# Altium schematic sheet Sheet1.SchDoc
size A3; SheetNumber: 1; SheetTotal: 1
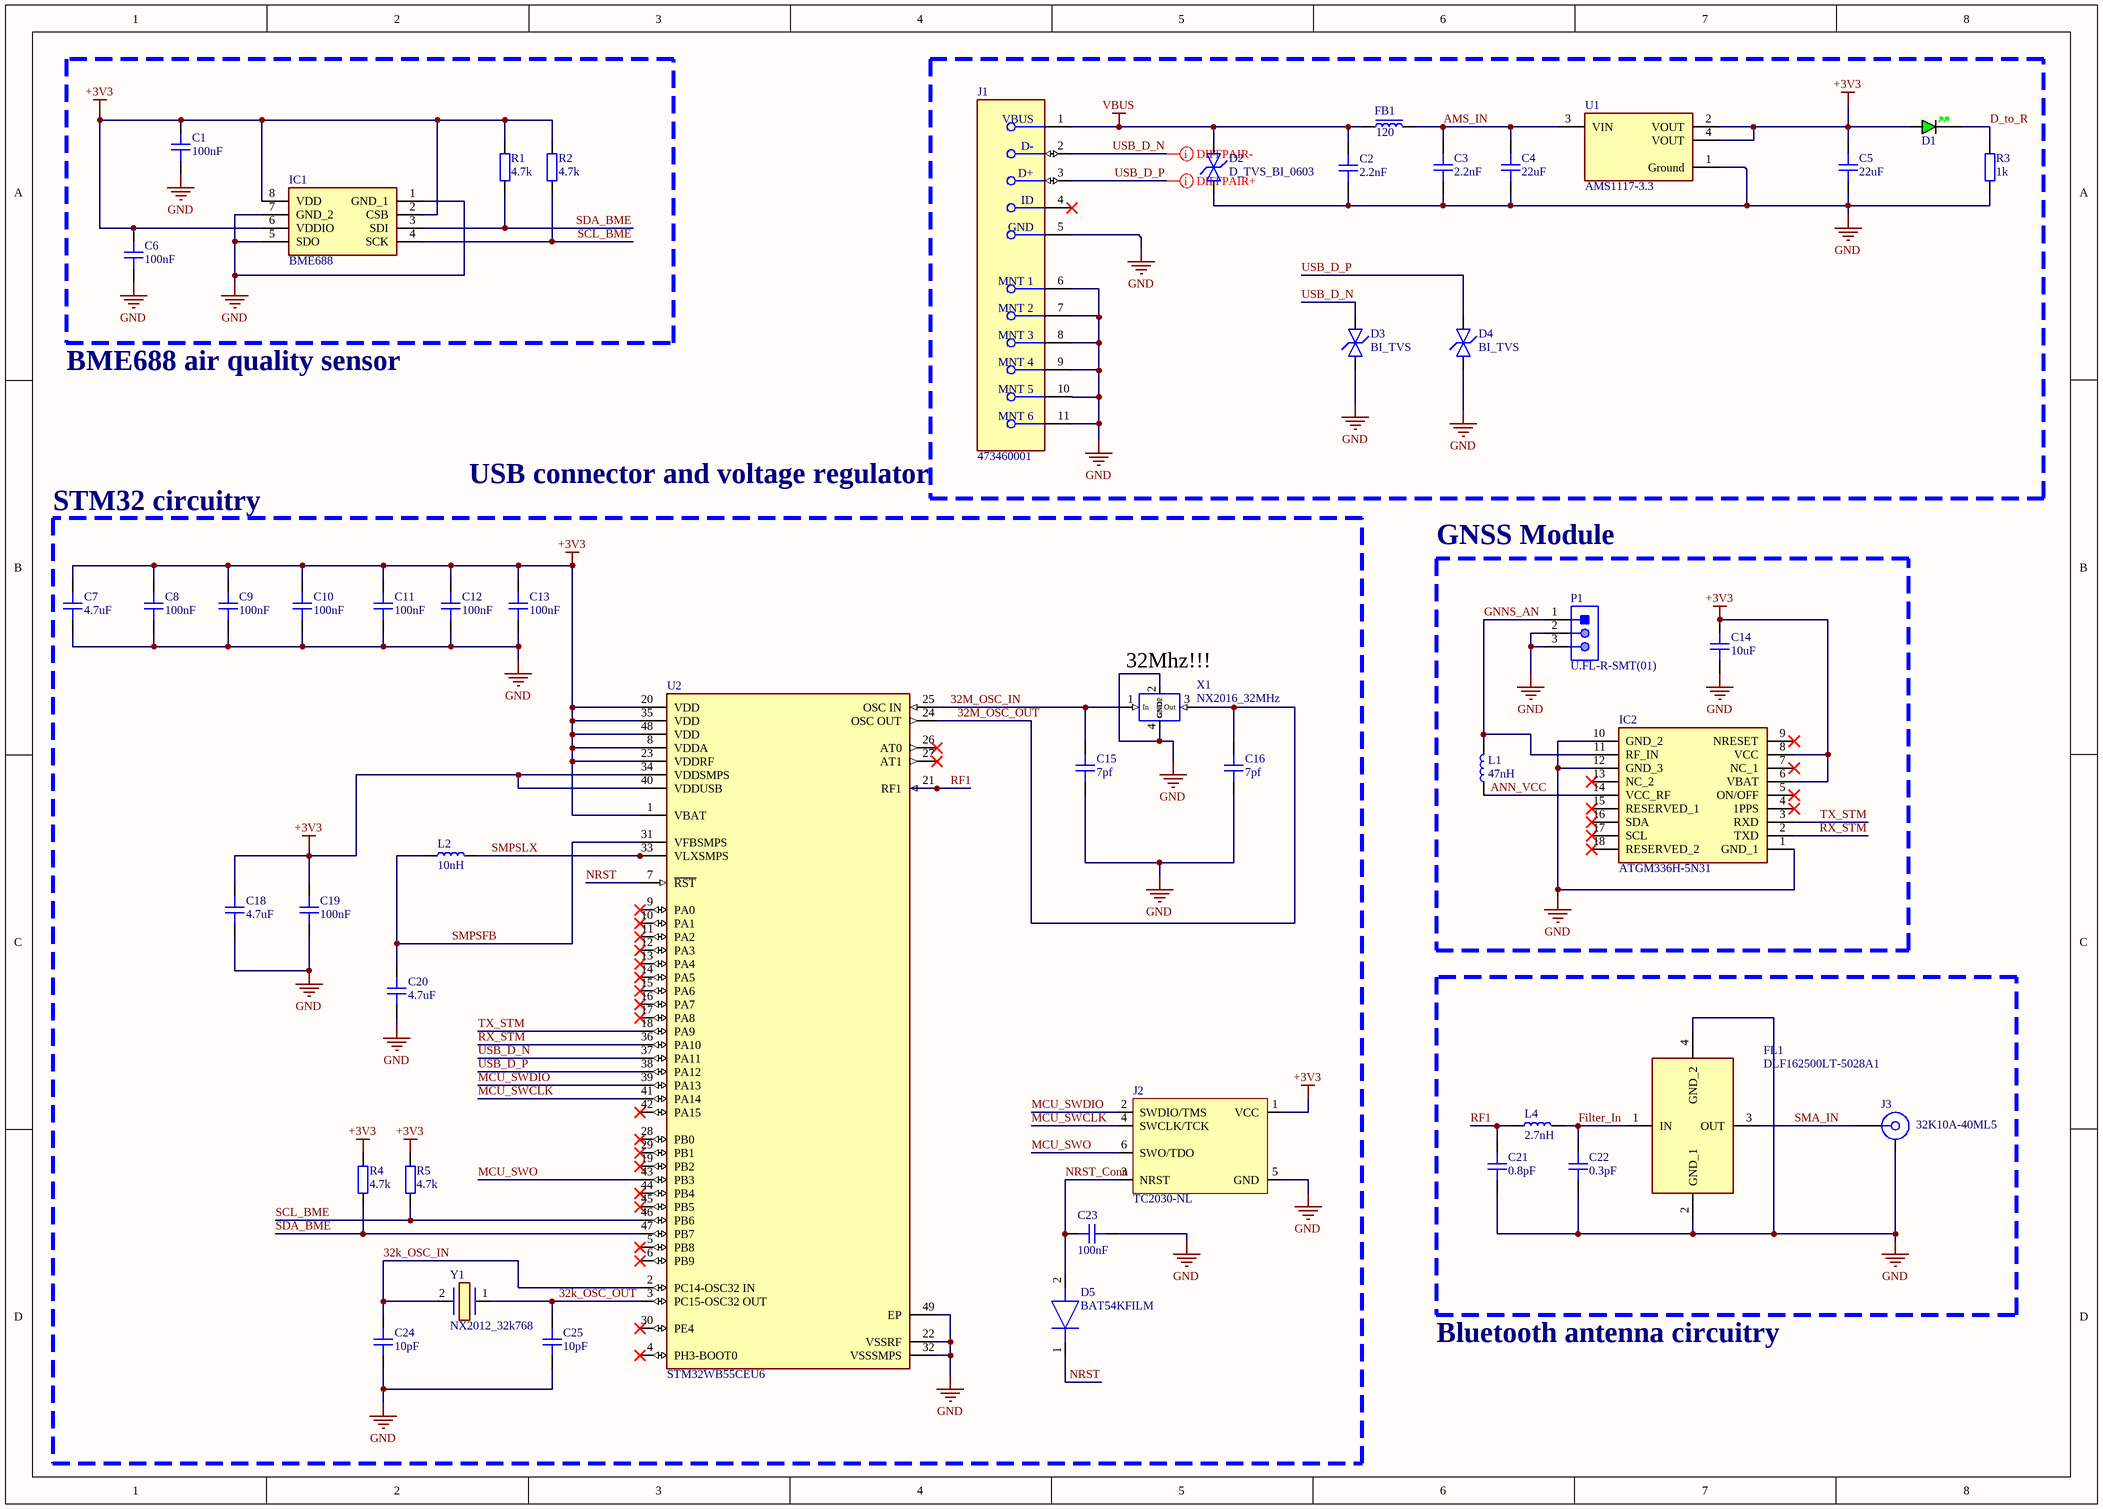
[diagram p0: Sheet1.SchDoc]

## Parts
C1  100nF  [CAP_0402]
C2  2.2nF  [CAP_0603]
C3  2.2nF  [CAP_0603]
C4  22uF  [CAP_0805]
C5  22uF  [CAP_0805]
C6  100nF  [CAP_0402]
C7  4.7uF  [CAP_0603]
C8  100nF  [CAP_0402]
C9  100nF  [CAP_0402]
C10  100nF  [CAP_0402]
C11  100nF  [CAP_0402]
C12  100nF  [CAP_0402]
C13  100nF  [CAP_0402]
C14  10uF  [CAP_0603]
C15  7pf  [CAP_0402]
C16  7pf  [CAP_0402]
C18  4.7uF  [CAP_0603]
C19  100nF  [CAP_0402]
C20  4.7uF  [CAP_0603]
C21  0.8pF  [CAP_0402]
C22  0.3pF  [CAP_0402]
C23  100nF  [CAP_0402]
C24  10pF  [CAP_0402]
C25  10pF  [CAP_0402]
D1  GREEN  [LED_0402_GREEN]  (value not drawn)
D2  D_TVS_BI_0603  [D_0603]
D3  BI_TVS  [D_0603]
D4  BI_TVS  [D_0603]
D5  BAT54KFILM  [SODFL1608X70N]
FB1  120  [FB_0603]
FL1  DLF162500LT-5028A1  [DLF162500LT5028A1]
IC1  BME688  [BME688]
IC2  ATGM336H-5N31  [ATGM336H5N31]
J1  473460001  [FP-473460001-MFG]
J2  TC2030-NL  [TC2030-NL-FP]  (no BOM)
J3  32K10A-40ML5  [ROS-32K10A-40ML5_V]
L1  47nH  [IND_0402]
L2  10nH  [IND_0603]
L4  2.7nH  [IND_0402]
P1  U.FL-R-SMT(01)  [HRS-U.FL-R-SMT(10)_V]
R1  4.7k  [RES_0603]
R2  4.7k  [RES_0603]
R3  1k  [RES_0402]
R4  4.7k  [RES_0402]
R5  4.7k  [RES_0402]
U1  AMS1117-3.3  [FP-AMS1117-IPC_C]
U2  STM32WB55CEU6  [FP-UFQFPN48-A0B9-MFG]
X1  NX2016_32MHz  [PCBComponent_1]
Y1  NX2012_32k768  [NX2012SA32768KSTDMUB1]

## Blocks framed on the sheet
BME688 air quality sensor: C1 C6 IC1 R1 R2
USB connector and voltage regulator: C2-C5 D1-D4 FB1 J1 R3 U1
STM32 circuitry: C7-C13 C15 C16 C18-C20 C23-C25 D5 J2 L2 R4 R5 U2 X1 Y1
GNSS Module: C14 IC2 L1 P1
Bluetooth antenna circuitry: C21 C22 FL1 J3 L4

## Nets
+3V3: C1.2 C5.2 C6.2 C7.2 C8.2 C9.2 C10.2 C11.2 C12.2 C13.2 C14.2 C18.2 C19.2 D1.A IC1.2(CSB) IC1.6(VDDIO) IC1.8(VDD) IC2.6(VBAT) IC2.8(VCC) J2.1(VCC) R1.2 R2.2 R4.2 R5.2 U1.2(VOUT) U1.4(VOUT) U2.1(VBAT) U2.8(VDDA) U2.20(VDD) U2.23(VDDRF) U2.34(VDDSMPS) U2.35(VDD) U2.40(VDDUSB) U2.48(VDD)
GND: C1.1 C2.1 C3.1 C4.1 C5.1 C6.1 C7.1 C8.1 C9.1 C10.1 C11.1 C12.1 C13.1 C14.1 C15.1 C16.1 C18.1 C19.1 C20.1 C21.1 C22.1 C23.1 C24.1 C25.1 D2.K D3.K D4.K FL1.2(GND_1) FL1.4(GND_2) IC1.1(GND_1) IC1.5(SDO) IC1.7(GND_2) IC2.1(GND_1) IC2.10(GND_2) IC2.12(GND_3) J1.5(GND) J1.6(MNT_1) J1.7(MNT_2) J1.8(MNT_3) J1.9(MNT_4) J1.10(MNT_5) J1.11(MNT_6) J2.5(GND) J3.MP P1.2 P1.3 R3.1 U1.1(Ground) U2.22(VSSRF) U2.32(VSSSMPS) U2.49(EP) X1.2(GND1) X1.4(GND2)
VBUS: C2.2 D2.A FB1.1 J1.1(VBUS)
32k_OSC_IN: C24.2 U2.2(PC14-OSC32_IN) Y1.2(CRYSTAL_2)
32k_OSC_OUT: C25.2 U2.3(PC15-OSC32_OUT) Y1.1(CRSYTAL_1)
32M_OSC_IN: C15.2 U2.25(OSC_IN) X1.1(In)
32M_OSC_OUT: C16.2 U2.24(OSC_OUT) X1.3(Out)
AMS_IN: C3.2 C4.2 FB1.2 U1.3(VIN)
ANN_VCC: IC2.14(VCC_RF) L1.1
D_to_R: D1.K R3.2
Filter_In: C22.2 FL1.1(IN) L4.2
GNNS_AN: IC2.11(RF_IN) L1.2 P1.1
MCU_SWCLK: J2.4(SWCLK/TCK) U2.41(PA14)
MCU_SWDIO: J2.2(SWDIO/TMS) U2.39(PA13)
MCU_SWO: J2.6(SWO/TDO) U2.43(PB3)
NRST: D5.1(K) U2.7(~{RST})
NRST_Conn: C23.2 D5.2(A) J2.3(NRST)
RF1: C21.2 L4.1 U2.21(RF1)
RX_STM: IC2.2(TXD) U2.36(PA10)
SCL_BME: IC1.4(SCK) R2.1 R5.1 U2.46(PB6)
SDA_BME: IC1.3(SDI) R1.1 R4.1 U2.47(PB7)
SMA_IN: FL1.3(OUT) J3.1
SMPSFB: C20.2 L2.1 U2.31(VFBSMPS)
SMPSLX: L2.2 U2.33(VLXSMPS)
TX_STM: IC2.3(RXD) U2.18(PA9)
USB_D_N: D3.A J1.2(D-) U2.37(PA11)
USB_D_P: D4.A J1.3(D+) U2.38(PA12)

Not connected (* = marked no-connect by the designer): IC2 4(1PPS)* 5(ON/OFF)* 7(NC_1)* 9(NRESET)* 13(NC_2)* 15(RESERVED_1)* 16(SDA)* 17(SCL)* 18(RESERVED_2)*; J1 4(ID)*; U2 4(PH3-BOOT0)* 5(PB8)* 6(PB9)* 9(PA0)* 10(PA1)* 11(PA2)* 12(PA3)* 13(PA4)* 14(PA5)* 15(PA6)* 16(PA7)* 17(PA8)* 19(PB2)* 26(AT0)* 27(AT1)* 28(PB0)* 29(PB1)* 30(PE4)* 42(PA15)* 44(PB4)* 45(PB5)*

## Layout directives
differential pair; differential pair class DIFF_USB: USB_D_N, USB_D_P

## Notes on the sheet
- (near X1) 32Mhz!!!

## Library data of the parts
C1 C6 C8-C13 C15 C16 C19 C21-C25 = CAP_0402: Capacitor SMD 0402; Manufacturer: *; Manufacturer Part Number: *; Distributor Link: *; LCSC: *; Rating: *; Dielectric: *
C2 C3 C7 C14 C18 C20 = CAP_0603: Capacitor SMD 0603; Manufacturer: *; Manufacturer Part Number: *; Distributor Link: *; LCSC: *; Rating: *; Dielectric: *
C4 C5 = CAP_0805: Capacitor SMD 0805; Manufacturer: *; Manufacturer Part Number: *; Distributor Link: *; LCSC: *; Rating: *; Dielectric: *
D1 = LED_0402_GREEN: LED 0402 GREEN SMD
D2-D4 = D_TVS_BI_0603: Diode TVS / ESD Bidirectional 0603; Manufacturer: *; Manufacturer Part Number: *
D5 = BAT54KFILM: Diode; Manufacturer_Name: STMicroelectronics; Datasheet Link: https://www.st.com/resource/en/datasheet/bat54.pdf; Height: 0.7mm; Manufacturer_Part_Number: BAT54KFILM; Mouser Part Number: 511-BAT54KFILM; Mouser Price/Stock: https://www.mouser.co.uk/ProductDetail/STMicroelectronics/BAT54KFILM?qs=jZi1jxfVU95Y9ce6l3OT%252BA%3D%3D; Arrow Part Number: BAT54KFILM; Arrow Price/Stock: https://www.arrow.com/en/products/bat54kfilm/stmicroelectronics?region=europe
FB1 = FB_0603: Ferrite Bead SMD 0603; Manufacturer: *; Manufacturer Part Number: *; Distributor Link: *; LCSC: *
FL1 = DLF162500LT-5028A1: Filter; Manufacturer_Name: TDK; Datasheet Link: https://product.tdk.com/system/files/dam/doc/product/rf/rf/filter/catalog/rf_lpf_dlf162500lt-5028a1_en.pdf; Height: 0.4mm; Manufacturer_Part_Number: DLF162500LT-5028A1; Mouser Part Number: 810-DLF16250LT5028A1; Mouser Price/Stock: https://www.mouser.co.uk/ProductDetail/TDK/DLF162500LT-5028A1?qs=U%2FZX79kHR%2FlwIbAISCs3qA%3D%3D; Arrow Part Number: DLF162500LT-5028A1; Arrow Price/Stock: https://www.arrow.com/en/products/dlf162500lt-5028a1/tdk?utm_currency=USD&region=nac
IC1 = BME688: Integrated Circuit; Manufacturer_Name: BOSCH; Datasheet Link: https://www.bosch-sensortec.com/media/boschsensortec/downloads/datasheets/bst-bme688-ds000.pdf; Height: 1mm; Manufacturer_Part_Number: BME688; Mouser Part Number: 262-BME688; Mouser Price/Stock: https://www.mouser.co.uk/ProductDetail/Bosch-Sensortec/BME688?qs=IS%252B4QmGtzzqQoVDscqwx3A%3D%3D; Arrow Part Number: BME688; Arrow Price/Stock: https://www.arrow.com/en/products/bme688/bosch-sensortec?utm_currency=USD&region=nac
IC2 = ATGM336H-5N31: Integrated Circuit; Manufacturer_Name: ZHONGKEWEI; Datasheet Link: https://datasheet.lcsc.com/szlcsc/ZHONGKEWEI-ATGM336H-5N31_C90770.pdf; Height: 2.6mm; Manufacturer_Part_Number: ATGM336H-5N31
J1 = CMP-2000-05246-2: CONN RCPT USB2.0 MICRO B SMD R/A; Manufacturer: Molex; Conn Orientation: Right Angle; Is Female: yes; Shielding: true; Pitch: 0.65mm; Number Of Contacts: 5; Voltage Rating: 30V; Current Rating: 1.8A; Device Class L2: USB Connectors; Digikey Description: CONN RCPT USB2.0 MICRO B SMD R/A; Height: 2.945mm; RoHS: TRUE; ComponentLink2Description: Datasheet; Octopart: https://octopart.com/47346-0001-molex-7164928; Automotive: No; Package: 0; Category: Conn; Device Class L1: Connectors; Usb Standard: USB 2.0; Temperature: -30°C to +85°C; Temperature Range Low: -30°C; Footprint Url: https://www.molex.com/pdm_docs/sd/473460001_sd.pdf; ComponentLink2URL: https://www.molex.com/webdocs/datasheets/pdf/en-us/0473460001_IO_CONNECTORS.pdf; Lead Free: Yes; Manufacturer Part Number: 473460001; Contact Material: Gold,Nickel; Temperature Range High: +85°C; Device Class L3: unset
J2 = TC2030-NL: Tag-Connect No-Solder SWD Debug Connector (No Legs) DO NOT PLACE; Manufacturer: Tag-Connect; Manufacturer Part Number: TC2030-NL-FP
J3 = CMP-0751-00003-1: SMA Straight Jack, Up to 12.4 GHz, -55 to 155 degC; Manufacturer: Rosenberger; Design Note: Footprint in library is a generic example - only application specific footprint delivers High Performance; ComponentLink4Description: Series Overview / Design Note; ComponentLink3URL: http://rosenberger.de/ok/images/documents/db/32K10A-40ML5.pdf; ComponentLink3Description: Package Specification; ComponentLink1URL: http://www.rosenberger.de; PartNumber: 32K10A-40ML5; ComponentLink1Description: Manufacturer URL; ComponentLink2Description: Datasheet; PackageDescription: SMA Straight Jack, Press-Fit, 6.35 x 6.35 x 9.5 mm; ComponentLink5URL: http://www.rosenberger.com/en/contact/sales/; ComponentLink5Description: Webshop / RFQ; ComponentLink2URL: http://rosenberger.de/ok/images/documents/db/32K10A-40ML5.pdf; PackageVersion: e00; DatasheetVersion: e00; Mounting Technology: Surface Mount; PackageReference: 32K10A-40ML5; ComponentLink4URL: http://rosenberger.de/ok/images/documents/spez/32.pdf
L1 L4 = IND_0402: Inductor SMD 0402
L2 = IND_0603: Inductor SMD 0603
P1 = CMP-2000-05151-1: CONN RECPT ULTRA-MINI COAX SMD; Manufacturer: Hirose Electric; Centre Contact Resistance: 25mohm; Voltage Rating V AC: 60V; Female Contact Material: PhosphorBronze; Contact Resistance: 10mohm; Male Contact Material: Brass; Connector Type: UFLCoaxial; Connector Mounting: PCB; Impedance: 50ohm; Insulation Resistance: 500Mohm; Secondary Insulation Material: PBT; Frequency Max: 6GHz; Body Plating: Silver; External Length / Height: 2.5mm; Approval Category: UL94V-0; Female Contact Plating: Gold; Connector Mounting Orientation: PCBoard; VSWR: 1.3; Coaxial Termination: Solder; Body Style: StraightJack; SVHC: NoSVHC(18-Jun-2012); Jacket Material: LCP; Package Reference: U.FL-R-SMT(10); Datasheet Version: Feb-04; Outer Contact Resistance: 10mohm; Contact Plating: Gold; Mounting Type: PCBoard; Flammability Rating: UL94V-0; Operating Frequency Max: 6GHz; Termination Method: Solder; Male Contact Plating: Gold; Package Description: 3-Pin Surface Mount Device, Body 2.6 x 2.6 mm; Operating Temperature Min: -40degC; Manufacturer URL: https://www.hirose.com; Operating Temperature Max: 90degC; Contact Material: PhosphorBronze; Datasheet URL: http://www.farnell.com/datasheets/91524.pdf; Material: PhosphorBronze
R1 R2 = RES_0603: Resistor SMD 0603; Manufacturer: *; Manufacturer Part Number: *; Distributor Link: *; LCSC: *
R3-R5 = RES_0402: Resistor SMD 0402; Manufacturer: *; Manufacturer Part Number: *; Distributor Link: *; LCSC: *
U1 = CMP-209535-000001-1: LDO Voltage Regulators 1A, 3.3V; Manufacturer: Advanced Monolithic Systems; Dropout Voltage: 1.1V; Output Type: Fixed; Nominal Supply Current: 5mA; Max Power Dissipation: 1.2W; Max Supply Voltage: 15V; Number Of Outputs: 1; Standoff Height: 0.64mm; Max Junction Temp: +125°C; Height: 1.8mm; Package: AMS1117; Device Class L2: Power Management ICs; ComponentLink2Description: Datasheet; ComponentLink2URL: http://www.advanced-monolithic.com/pdf/ds1117.pdf; Category: IC; RoHS: TRUE; Automotive: No; Device Class L1: Integrated Circuits (ICs); Output Current: 1A; Device Class L3: Voltage Regulators - Linear; Temperature: -40°C to +125°C; Output Voltage: 3.3V; Manufacturer Part Number: AMS1117-3.3; Temperature Range Low: -40°C; Octopart: https://octopart.com/ams1117-3.3-advanced+monolithic+systems-25899300; Lead Free: Yes; Ipc Land Pattern Name: SOT229P700X180-4; Temperature Range High: +125°C
U2 = CMP-12160-000002-1: ULTRA-LOW-POWER DUAL CORE ARM CO; Manufacturer: STMicroelectronics; Max Junction Temp: +125°C; Data Rate: 2Mbits/s; Number Of Gpio: 30; Max Supply Voltage: 3.6V; Min Supply Voltage: 1.71V; Number Of Adc Channels: 13; Standoff Height: 0mm; Bandwidth: 2402-2480MHz; Max Frequency: 2480MHz; Interface: I2C,SPI,UART,USART,USB,Other; Max Power Dissipation: 392mW; Sensitivity: -100dBm; Temperature Range Low: -40°C; Digikey Description: ULTRA-LOW-POWER DUAL CORE ARM CO; Package: UFQFPN48-A0B9; ComponentLink2URL: https://www.st.com/resource/en/datasheet/stm32wb55rg.pdf; Ambient Temperature Range Low: -40°C; Automotive: No; Lead Free: Yes; RoHS: TRUE; Height: 0.65mm; Device Class L1: Integrated Circuits (ICs); Octopart: https://octopart.com/stm32wb55ceu6-stmicroelectronics-96611730; Device Class L2: RF Semiconductors and Devices; Ambient Temperature Range High: +105°C; Ipc Land Pattern Name: QFN50P700X700X57-48; Device Class L3: Transceivers; Category: IC; Temperature: -40°C to +125°C; ComponentLink2Description: Datasheet; Manufacturer Part Number: STM32WB55CEU6; Temperature Range High: +125°C
X1 = NX2016_32MHZ: 32 Megahertz crystal oscillator
Y1 = NX2012SA-32.768K-STD-MUB-1: Crystal or Oscillator; Manufacturer_Name: NDK; Datasheet Link: https://www.mouser.de/datasheet/2/905/c_NX2012SA-STD-MUB-1_e-1317508.pdf; Height: 0.6mm; Manufacturer_Part_Number: NX2012SA-32.768K-STD-MUB-1; Mouser Part Number: 344-NX2012SA32768K1; Mouser Price/Stock: https://www.mouser.co.uk/ProductDetail/NDK/NX2012SA-32.768K-STD-MUB-1?qs=55YtniHzbhA%252B6%2Fl1MwFZaQ%3D%3D